# EAGLE design STl-Link-V300 (EAGLE 7.6.0)
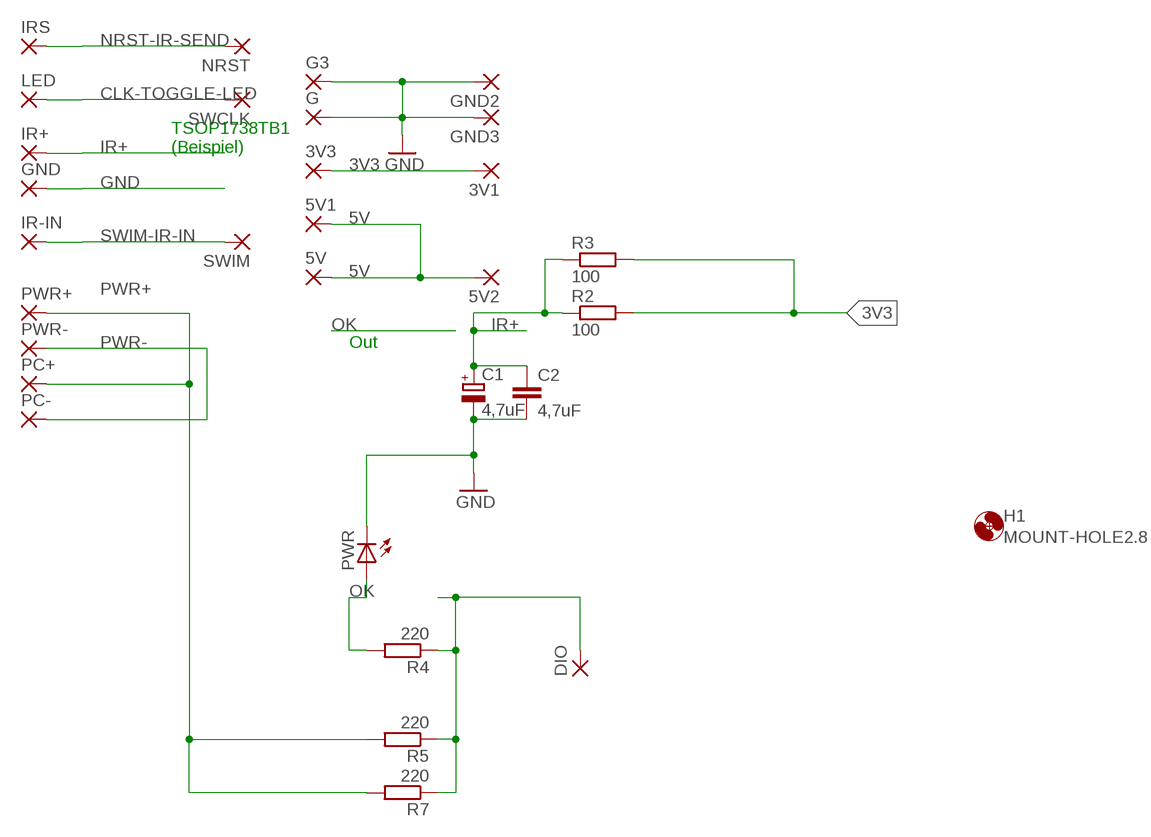
[diagram p0: schematic, sheet 1]

## Parts
3V1  SMD2  [SMD1,27-2,54]
3V3  SMD2  [SMD1,27-2,54]
5V  SMD2  [SMD1,27-2,54]
5V1  SMD2  [SMD1,27-2,54]
5V2  SMD2  [SMD1,27-2,54]
C1  4,7uF  CPOL-EUE1.8-4  [E1,8-4]
C2  4,7uF  C-EUC1206K  [C1206K]
DIO  SMD2  [SMD1,27-2,54]
G  SMD2  [SMD1,27-2,54]
G3  SMD2  [SMD1,27-2,54]
GND  SMD2  [SMD1,27-2,54]
GND2  SMD2  [SMD1,27-2,54]
GND3  SMD2  [SMD1,27-2,54]
H1  MOUNT-HOLE2.8  [2,8]
IR+  SMD2  [SMD1,27-2,54]
IR-IN  SMD2  [SMD1,27-2,54]
IRS  SMD2  [SMD1,27-2,54]
LED  SMD2  [SMD1,27-2,54]
NRST  SMD2  [SMD1,27-2,54]
PC+  SMD2  [SMD1,27-2,54]
PC-  SMD2  [SMD1,27-2,54]
PWR  LEDCHIPLED_1206  [CHIPLED_1206]
PWR+  SMD2  [SMD1,27-2,54]
PWR-  SMD2  [SMD1,27-2,54]
R2  100  R-EU_0204/7  [0204/7]
R3  100  R-EU_R0805W  [R0805W]
R4  220  R-EU_R0805W  [R0805W]
R5  220  R-EU_0204/7  [0204/7]
R7  220  R-EU_R0805W  [R0805W]
SWCLK  SMD2  [SMD1,27-2,54]
SWIM  SMD2  [SMD1,27-2,54]

## Nets
3V3: 3V1.1(P) 3V3.1(P) R2.2 R3.2
5V: 5V1.1(P) 5V2.1(P) 5V.1(P)
CLK-TOGGLE-LED: LED.1(P) SWCLK.1(P)
DIO-EINSCH: DIO.1(P) R4.1 R5.1 R7.1
GND: C1.- C2.2 G3.1(P) G.1(P) GND2.1(P) GND3.1(P) GND.1(P) PWR.C
IR+: C1.+ C2.1 IR+.1(P) R2.1 R3.1
NRST-IR-SEND: IRS.1(P) NRST.1(P)
OK: PWR.A R4.2
PWR+: PC+.1(P) PWR+.1(P) R5.2 R7.2
PWR-: PC-.1(P) PWR-.1(P)
SWIM-IR-IN: IR-IN.1(P) SWIM.1(P)

## Notes on the sheet
- TSOP1738TB1
  (Beispiel)
- Out

## Library data of the parts
3V1 3V3 5V 5V1 5V2 DIO G G3 GND GND2 GND3 IR+ IR-IN IRS LED NRST PC+ PC- PWR+ PWR- SWCLK SWIM = wirepad:SMD2: SMD PAD
C1 = rcl:CPOL-EU: POLARIZED CAPACITOR, European symbol
C2 = rcl:C-EU: CAPACITOR, European symbol
H1 = holes:MOUNT-HOLE: MOUNTING HOLE with drill center marker
PWR = led:LED: LED OSRAM: - CHIPLED LG R971, LG N971, LY N971, LG Q971, LY Q971, LO R971, LY R971 LH N974, LH R974 LS Q976, LO Q976, LY Q976 LO Q996 - Hyper CHIPLED LW Q18S LB Q993, LB Q99A, LB R99A - SideLED LS A670, LO A670, LY A670, LG A670, LP A670 LB A673, LV A673, LT A673, LW A673 LH A674 LY A675 LS A676, LA A676, LO A676, LY A676, LW A676 LS A679, LY A679, LG A679 - Hyper Micro SIDELED® LS Y876, LA Y876, LO Y876, LY Y876 LT Y87S - SmartLED LW L88C, LW L88S LB L89C, LB L89S, LG L890 LS L89K, LO L89K, LY L89K LS L896, LA L896, LO L896, LY L896 - TOPLED LS T670, LO T670, LY T670, LG T670, LP T670 LSG T670, LSP T670, LSY T670, LOP T670, LYG T670 LG T671, LOG T671, LSG T671 LB T673, LV T673, LT T673, LW T673 LH T674 LS T676, LA T676, LO T676, LY T676, LB T676, LH T676, LSB T676, LW T676 LB T67C, LV T67C, LT T67C, LS T67K, LO T67K, LY T67K, LW E67C LS E67B, LA E67B, LO E67B, LY E67B, LB E67C, LV E67C, LT E67C LW T67C LS T679, LY T679, LG T679 LS T770, LO T770, LY T770, LG T770, LP T770 LB T773, LV T773, LT T773, LW T773 LH T774 LS E675, LA E675, LY E675, LS T675 LS T776, LA T776, LO T776, LY T776, LB T776 LHGB T686 LT T68C, LB T68C - Hyper Mini TOPLED® LB M676 - Mini TOPLED Santana® LG M470 LS M47K, LO M47K, LY M47K Source: http://www.osram.convergy.de LUXEON: - LUMILED® LXK2-PW12-R00, LXK2-PW12-S00, LXK2-PW14-U00, LXK2-PW14-V00 LXK2-PM12-R00, LXK2-PM12-S00, LXK2-PM14-U00 LXK2-PE12-Q00, LXK2-PE12-R00, LXK2-PE12-S00, LXK2-PE14-T00, LXK2-PE14-U00 LXK2-PB12-K00, LXK2-PB12-L00, LXK2-PB12-M00, LXK2-PB14-N00, LXK2-PB14-P00, LXK2-PB14-Q00 LXK2-PR12-L00, LXK2-PR12-M00, LXK2-PR14-Q00, LXK2-PR14-R00 LXK2-PD12-Q00, LXK2-PD12-R00, LXK2-PD12-S00 LXK2-PH12-R00, LXK2-PH12-S00 LXK2-PL12-P00, LXK2-PL12-Q00, LXK2-PL12-R00 Source: www.luxeon.com KINGBRIGHT: KA-3528ASYC Source: www.kingbright.com
R2-R5 R7 = rcl:R-EU_: RESISTOR, European symbol

## Net classes
0 default: width 0.406 mm

## Board
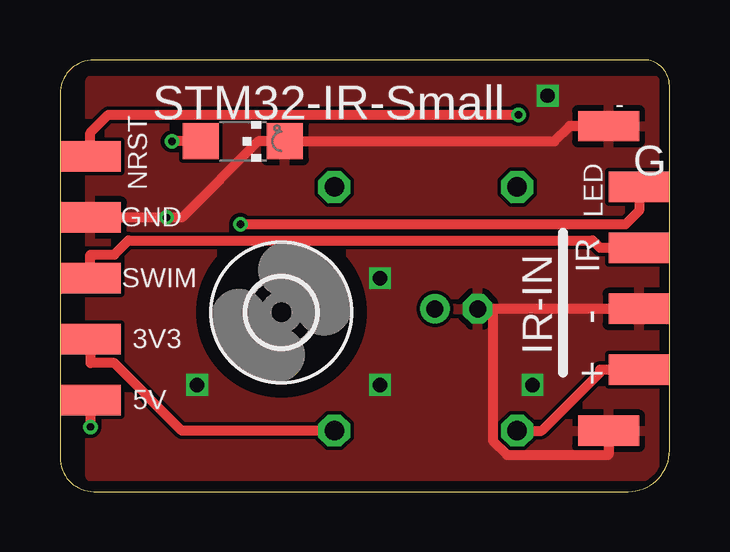
[diagram p1: board, top side]
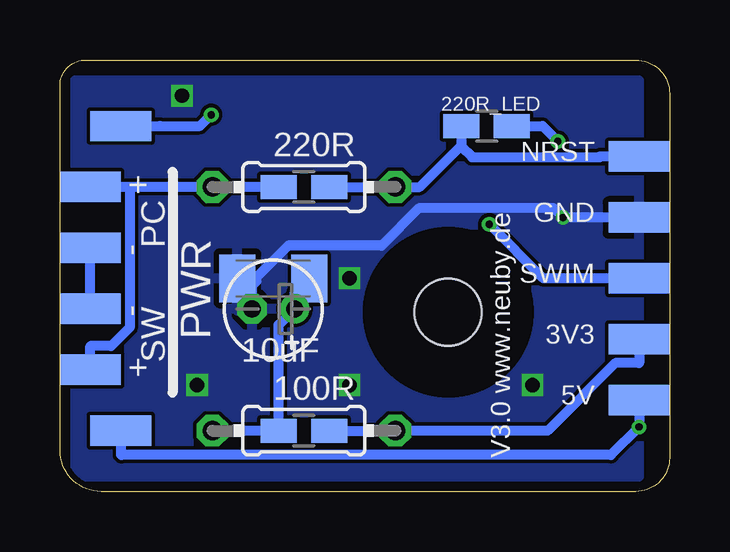
[diagram p2: board, bottom side, seen from below]

Size 25.4 x 18 mm. Coordinates in mm from the lower left corner, seen from the top.
Outline: 0,16.59 0,1.41 arc90 1.41,0 23.68,0 arc90 25.4,1.72 25.4,16.92 arc90 24.32,18 1.41,18 arc90 0,16.59
Copper layers (1*16): Top 0.035mm / dielectric 1.5mm / Bottom 0.035mm
Design rules "Fusion_eagle_rule_v1.1": minimum track width 6mil, minimum drill 12mil, track to track 6mil, track to pad 6mil, pad to pad 6mil, via to via 6mil, smd to smd 0mil, copper to edge 10mil, drill to drill 10mil, minimum pad ring 10mil, minimum via ring 6mil, stop-mask expansion 2mil, vias tented up to drill 100mil, thermal gap 10mil

### Footprints (pad centres in the part's own frame; a part is rotated, then mirrored left to right if it is on the bottom)
SMD1,27-2,54 = smd 1.27 x 2.54: 1 0,0
E1,8-4 = drill 0.711 pad 1.168: + -0.889,0 | drill 0.711 pad 1.168 octagon: - 0.889,0
C1206K = smd 1.5 x 2: 1 -1.5,0; 2 1.5,0
2,8 = hole 2.8: 0,0
CHIPLED_1206 = smd 1.5 x 1.5: A 0,-1.75; C 0,1.75
0204/7 = drill 0.813 octagon: 1 -3.81,0; 2 3.81,0
R0805W = smd 1.5 x 1: 1 -1.052,0; 2 1.052,0

### Placement (x,y rotation side)
3V1  1.27,6.35 90 top
3V3  1.27,6.35 90 bottom
5V  22.86,2.54 270 bottom
5V1  1.27,3.81 90 bottom
5V2  1.27,3.81 90 top
C1  16.51,7.62 180 bottom
C2  16.51,8.89 180 bottom
DIO  1.27,13.97 90 bottom
G  22.86,15.24 90 top
G3  22.86,2.54 90 top
GND  24.13,7.62 90 top
GND2  1.27,11.43 90 top
GND3  1.27,11.43 90 bottom
H1  9.22,7.47 0 top
IR+  24.13,5.08 90 top
IR-IN  24.13,10.16 90 top
IRS  22.86,15.24 270 bottom
LED  24.13,12.7 270 top
NRST  1.27,13.97 90 top
PC+  24.13,12.7 90 bottom
PC-  24.13,10.16 90 bottom
PWR  7.62,14.61 270 top
PWR+  24.13,5.08 90 bottom
PWR-  24.13,7.62 90 bottom
R2  15.24,2.54 0 bottom
R3  15.24,2.54 0 bottom
R4  7.62,15.24 0 bottom
R5  15.24,12.7 180 bottom
R7  15.24,12.7 180 bottom
SWCLK  1.27,8.89 90 bottom
SWIM  1.27,8.89 90 top

### Tracks (layer width: path | path; a pad name or v marks a point on that pad's centre or on a via)
3V3
  Top 0.406: 3V1.1 1.27,5.36 2.26,5.36 5.08,2.54 R2.2
  Bottom 0.406: 3V1.1 1.27,5.36 2.26,5.36 5.08,2.54 R2.2 R3.2
5V  (via drill 0.3 pad 0.61)
  Top 0.406: 5V2.1 v1.27,2.69
  Bottom 0.406: 5V.1 22.86,1.55 22.83,1.52 2.44,1.52 v1.27,2.69 5V2.1
CLK-TOGGLE-LED  (via drill 0.3 pad 0.61)
  Top 0.406: v7.52,11.15 23.57,11.15 24.13,11.71 LED.1
  Bottom 0.406: SWCLK.1 5.26,8.89 v7.52,11.15
DIO-EINSCH
  Bottom 0.406: DIO.1 2.9,13.97 2.92,13.94 8.23,13.94 8.67,14.38 | 8.67,14.38 8.67,14.52 R4.1 | 8.67,14.38 8.73,14.38 10.41,12.7 R5.1 R7.1
GND  (via drill 0.3 pad 0.61, 0.6)
  Top 0.406: GND3.1 v4.44,11.43 5.09,11.43 8.26,14.61 PWR.C 20.6,14.61 21.23,15.24 G.1 | 18.03,7.62 C1.- | GND.1 18.03,7.62 | 18.03,7.62 18.03,2.12 18.63,1.52 22.83,1.52 22.86,1.55 G3.1
  Bottom 0.406: 17.22,8.89 17.22,8.94 15.89,10.26 12,10.26 10.44,11.81 4.82,11.81 v4.44,11.43 2.9,11.43 GND3.1 | 17.22,8.89 17.22,8.77 17.4,8.59 C1.- | C2.2 17.22,8.89
  other vias: 5.71,4.45 13.34,4.45 19.68,4.45 20.32,16.51 13.34,8.89
  pour Bottom: 1.27,17.14 24.77,17.14 24.77,0.64 1.27,0.64
  pour Top: 1.27,0.64 1.27,17.14 24.77,17.14 24.77,0.64
IR+
  Top 0.406: IR+.1 22.5,5.08 22.5,4.98 20.07,2.54 R2.1
  Bottom 0.406: R2.1 18.03,2.54 R3.1 16.29,6.95 C1.+ 15.62,8.28 C2.1
NRST-IR-SEND  (via drill 0.3 pad 0.61)
  Top 0.406: v19.1,15.71 2.02,15.71 1.27,14.96 NRST.1
  Bottom 0.406: v19.1,15.71 19.57,15.24 21.23,15.24 IRS.1
OK  (via drill 0.3 pad 0.61)
  Top 0.406: v4.66,14.61 4.76,14.61 PWR.A
  Bottom 0.406: R4.2 5.29,15.24 v4.66,14.61
PWR+
  Bottom 0.406: 22.5,12.7 PC+.1 | 22.5,12.7 R5.2 R7.2 | 22.5,12.7 22.5,6.84 23.27,6.07 24.13,6.07 PWR+.1
PWR-
  Bottom 0.406: PWR-.1 PC-.1
SWIM-IR-IN
  Top 0.406: IR-IN.1 22.5,10.16 22.19,10.47 2.85,10.47 2.26,9.88 1.27,9.88 SWIM.1

### Text on the board
tNames: - | STM32-IR-Small | NRST | GND | LED | SWIM | IR | 3V3 | - | IR-IN | 5V | +
bNames: 220R_LED | NRST | 220R | GND | + | SWIM | PC | - | 3V3 | - | PWR | 10uF | SW | + | 5V | 100R | V3.0 www.neuby.de
tValues: www.neuby.de
bValues: IRSen | - | 5V